# Altium project bigpine-camera.PrjPCB
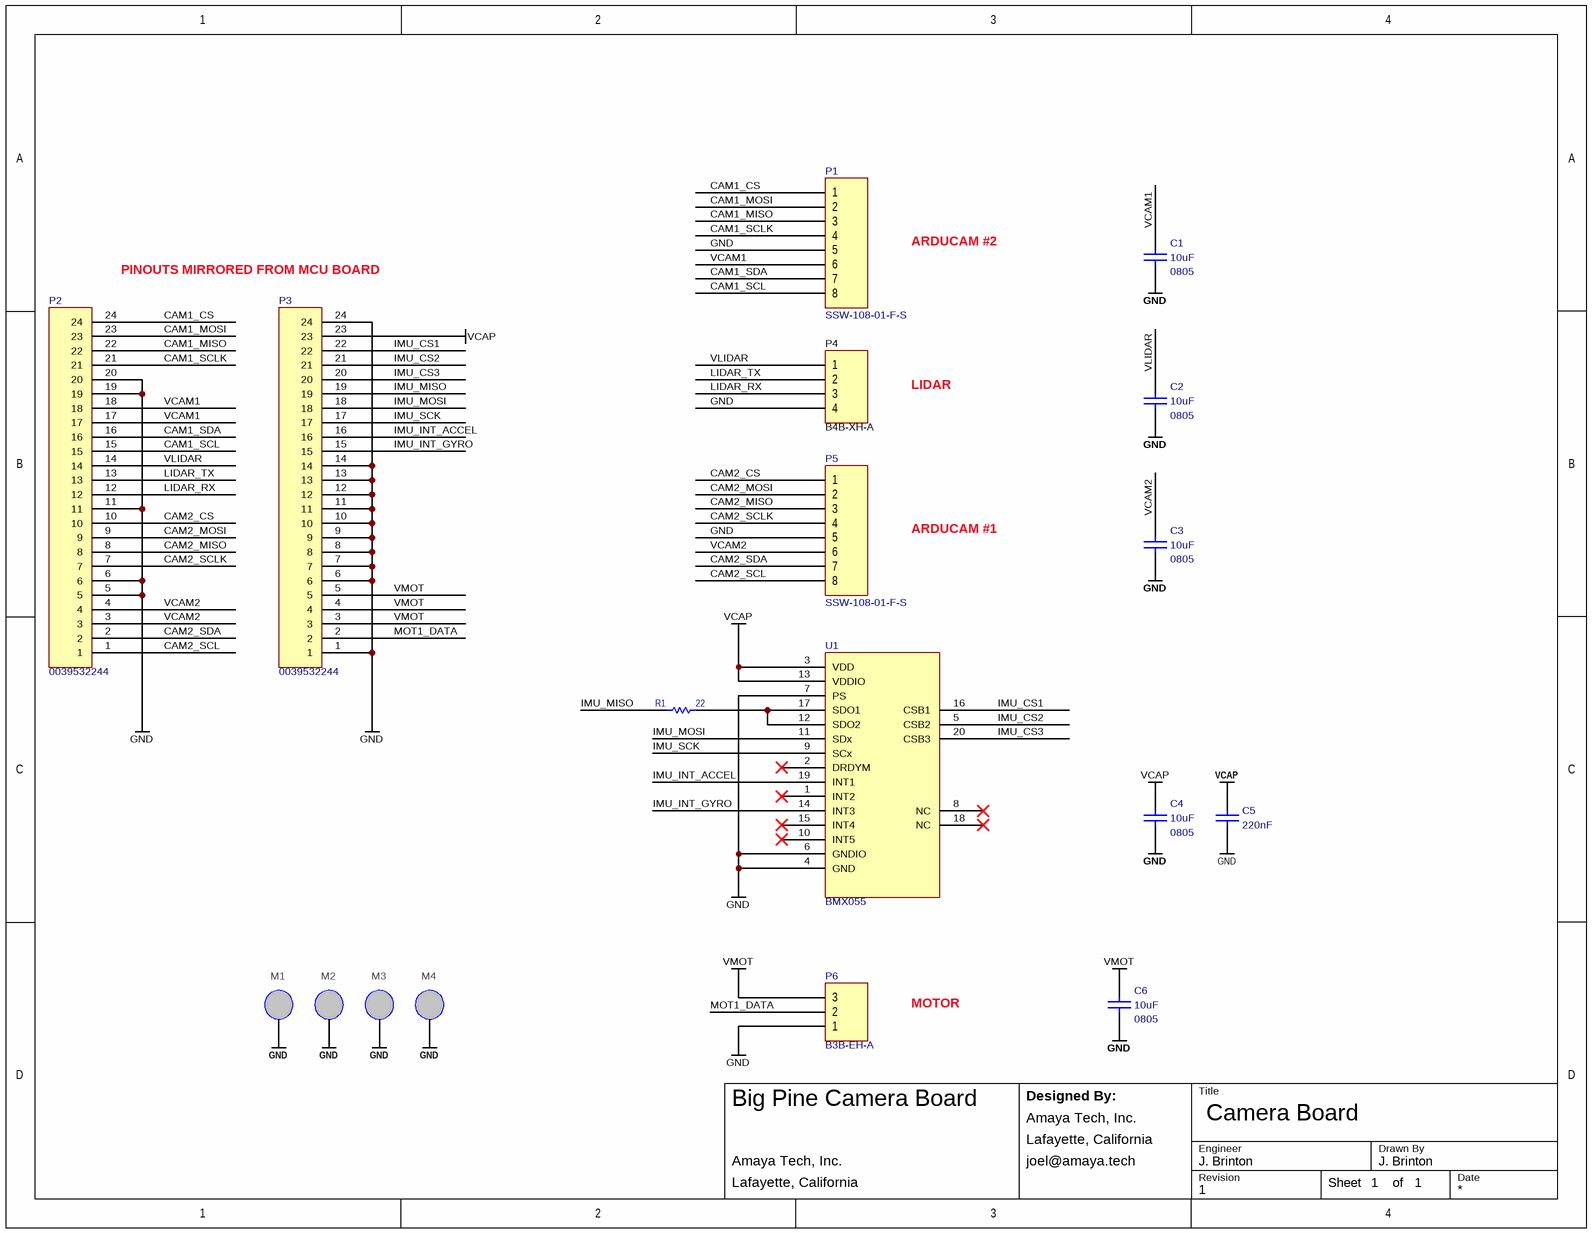
[diagram p0: camera.SchDoc]
Client: Amaya Tech, Inc.; ClientAddress: Lafayette, California; ClientProject: Big Pine Camera Board; Company: Amaya Tech, Inc.; CompanyAddress: Lafayette, California; CompanyEmail: joel@amaya.tech
1 sheet, 18 parts. Net scope: global (net labels, ports and power ports of the same name join across sheets).
Board file: bigpine-camera.PcbDoc

## Sheet camera.SchDoc: Camera Board
size Letter; DrawnBy: J. Brinton; Engineer: J. Brinton; Revision: 1; SheetNumber: 1; SheetTotal: 1

### Parts
C1  value 10uF  Package: 0805  [CAPC200X125X145L45N]  (hidden comment: CL21B106KOQNNNE)
C2  value 10uF  Package: 0805  [CAPC200X125X145L45N]  (hidden comment: CL21B106KOQNNNE)
C3  value 10uF  Package: 0805  [CAPC200X125X145L45N]  (hidden comment: CL21B106KOQNNNE)
C4  value 10uF  Package: 0805  [CAPC200X125X145L45N]  (hidden comment: CL21B106KOQNNNE)
C5  value 220nF  [CAPC100X50X55L25N]  (hidden comment: C1005X7R1E224K050BE)
C6  value 10uF  Package: 0805  [CAPC200X125X145L45N]  (hidden comment: CL21B106KOQNNNE)
M1  MOUNT  [M4_MOUNT]  (value not drawn)  (no BOM)
M2  MOUNT  [M4_MOUNT]  (value not drawn)  (no BOM)
M3  MOUNT  [M4_MOUNT]  (value not drawn)  (no BOM)
M4  MOUNT  [M4_MOUNT]  (value not drawn)  (no BOM)
P1  SSW-108-01-F-S  [SSW-108-01-F-S]
P2  0039532244  [0039532244]
P3  0039532244  [0039532244]
P4  B4B-XH-A  [HDR1X4]
P5  SSW-108-01-F-S  [SSW-108-01-F-S]
P6  B3B-EH-A  [B3B-EH-A]
R1  value 22  [RESC2012X70N]  (hidden comment: ERJ-6ENF22R0V)
U1  BMX055  [BMX055]

### Nets
GND: C1.2 C2.2 C3.2 C4.2 C5.2 C6.2 M1.1(MNT) M2.1(MNT) M3.1(MNT) M4.1(MNT) P1.5 P2.5 P2.6 P2.11 P2.19 P2.20 P3.1 P3.6 P3.7 P3.8 P3.9 P3.10 P3.11 P3.12 P3.13 P3.14 P3.24 P4.4 P5.5 P6.1 U1.4(GND) U1.6(GNDIO) U1.7(PS)
VCAP: C4.1 C5.1 P3.23 U1.3(VDD) U1.13(VDDIO)
VMOT: C6.1 P3.3 P3.4 P3.5 P6.3
CAM1_CS: P1.1 P2.24
CAM1_MISO: P1.3 P2.22
CAM1_MOSI: P1.2 P2.23
CAM1_SCL: P1.8 P2.15
CAM1_SCLK: P1.4 P2.21
CAM1_SDA: P1.7 P2.16
CAM2_CS: P2.10 P5.1
CAM2_MISO: P2.8 P5.3
CAM2_MOSI: P2.9 P5.2
CAM2_SCL: P2.1 P5.8
CAM2_SCLK: P2.7 P5.4
CAM2_SDA: P2.2 P5.7
IMU_CS1: P3.22 U1.16(CSB1)
IMU_CS2: P3.21 U1.5(CSB2)
IMU_CS3: P3.20 U1.20(CSB3)
IMU_INT_ACCEL: P3.16 U1.19(INT1)
IMU_INT_GYRO: P3.15 U1.14(INT3)
IMU_MISO: P3.19 R1.2
IMU_MOSI: P3.18 U1.11(SDx)
IMU_SCK: P3.17 U1.9(SCx)
LIDAR_RX: P2.12 P4.3
LIDAR_TX: P2.13 P4.2
MOT1_DATA: P3.2 P6.2
VCAM1: C1.1 P1.6 P2.17 P2.18
VCAM2: C3.1 P2.3 P2.4 P5.6
VLIDAR: C2.1 P2.14 P4.1
NetR1_1: R1.1 U1.12(SDO2) U1.17(SDO1)

Not connected (* = marked no-connect by the designer): U1 1(INT2)* 2(DRDYM)* 8(NC)* 10(INT5)* 15(INT4)* 18(NC)*

### Notes on the sheet
- ARDUCAM #2
- PINOUTS MIRRORED FROM MCU BOARD
- LIDAR
- ARDUCAM #1
- MOTOR
- Designed By:
- Title
- Engineer
- Revision
- Drawn By
- Date
- Sheet
- of

### Library data of the parts
C1-C4 C6 = LMK212B7106KG: Ceramic Capacitor 10uF ±10% 16V X7R 0805; Manufacturer: Samsung; Tr: -55:105; Manufacturer P/N: CL21B106KOQNNNE; Tolerance: ±10%; Voltage: 16V
C5 = TMK105B7224KV: Ceramic Capacitor 220nF ±10% 25V X7R 0402; Manufacturer: TDK; Manufacturer P/N: C1005X7R1E224K050BE; Tolerance: ±10%; Tr: *; Package: 0402; Voltage: 25V
P1 P5 = Header 8: Through-hole post socket 0.1" pitch; Manufacturer: Samtec; Manufacturer P/N: SSW-108-01-F-S
P2 P3 = 0039532244: FPC connector; Manufacturer: Molex; Manufacturer P/N: 0039532244
P4 = Header 4: Header, 4-Pin; Manufacturer: JST; Manufacturer P/N: B4B-XH-A
P6 = Header 3: 2.5mm pitch crimp connector; Manufacturer: JST; Manufacturer P/N: B3B-EH-A
R1 = RES 0402: Thick Film Resistor 22 ±1% 0805; Manufacturer: Panasonic; Tr: -55:155; Package: 0805; Manufacturer P/N: ERJ-6ENF22R0V; Tolerance: ±1%
U1 = BMX055: 9-DOF Sensor Module; Manufacturer: Bosch; Manufacturer P/N: BMX055
M1-M4 = MOUNT: Manufacturer: *; Manufacturer P/N: *